# Altium schematic sheet PERIPHERALS.SchDoc
size A4; SheetNumber: 7; SheetTotal: 9
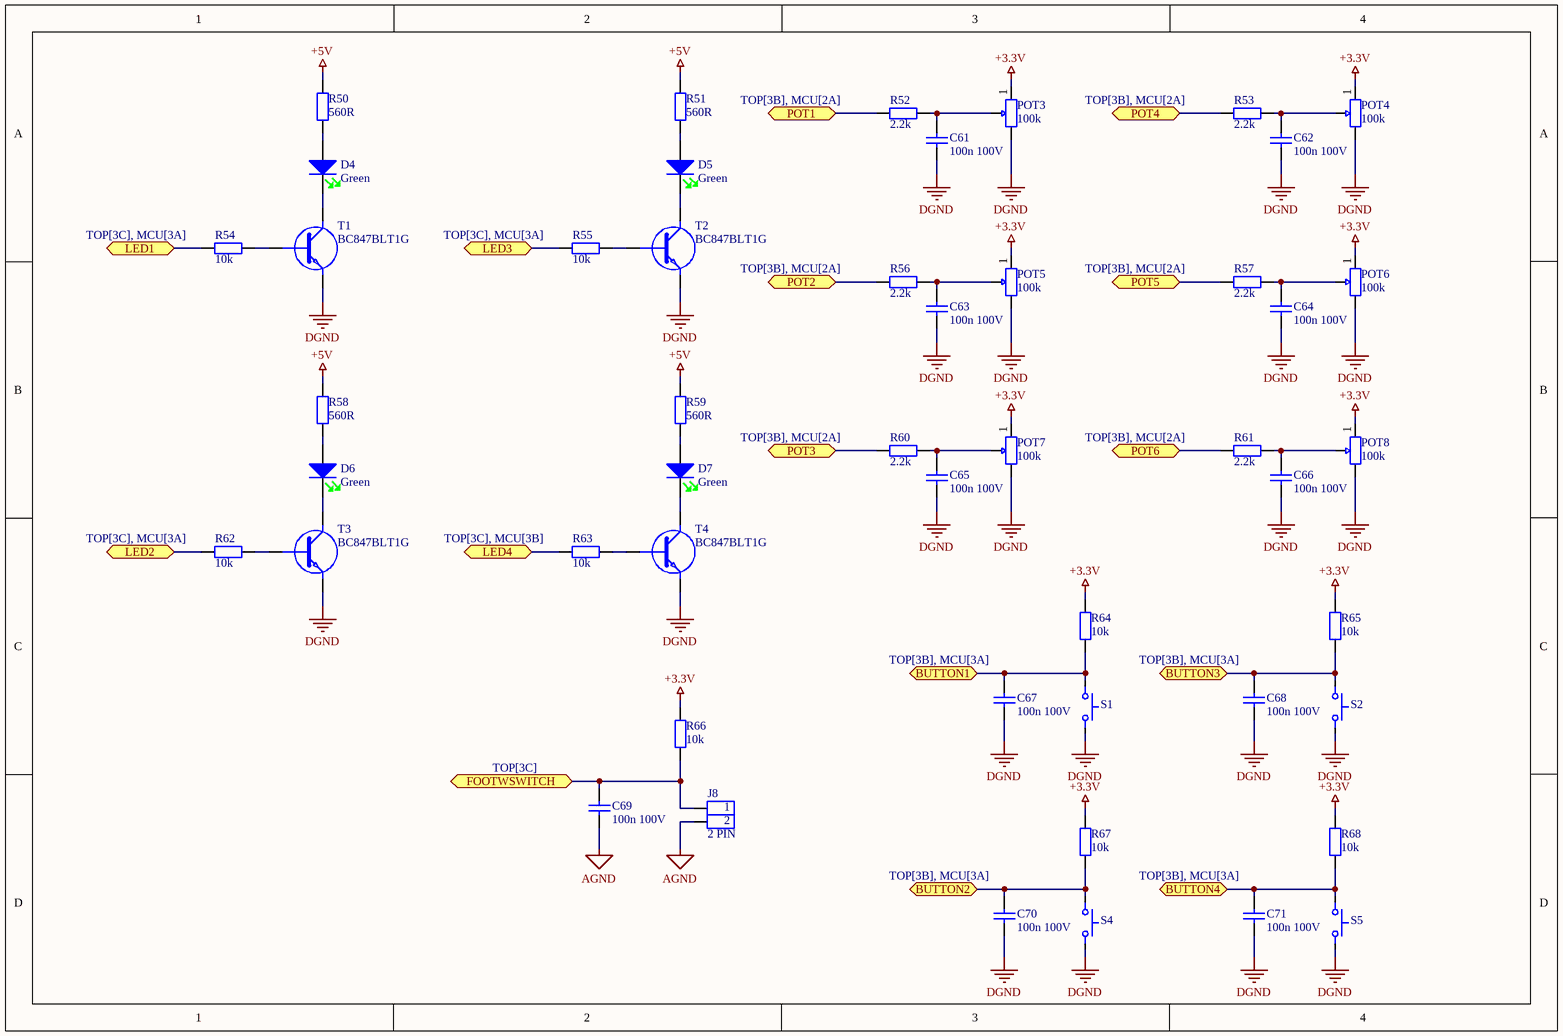
[diagram p0: PERIPHERALS.SchDoc]

## Parts
C61  100n 100V  [CAPACITOR 0805]
C62  100n 100V  [CAPACITOR 0805]
C63  100n 100V  [CAPACITOR 0805]
C64  100n 100V  [CAPACITOR 0805]
C65  100n 100V  [CAPACITOR 0805]
C66  100n 100V  [CAPACITOR 0805]
C67  100n 100V  [CAPACITOR 0805]
C68  100n 100V  [CAPACITOR 0805]
C69  100n 100V  [CAPACITOR 0805]
C70  100n 100V  [CAPACITOR 0805]
C71  100n 100V  [CAPACITOR 0805]
D4  Green  [LED 3MM GREEN]
D5  Green  [LED 3MM GREEN]
D6  Green  [LED 3MM GREEN]
D7  Green  [LED 3MM GREEN]
J8  2 PIN  [MECHANICAL PINHEADER 2P 2.54MM MALE]
POT3  100k  [POTENTIOMETER PTV09A W\H]
POT4  100k  [POTENTIOMETER PTV09A W\H]
POT5  100k  [POTENTIOMETER PTV09A W\H]
POT6  100k  [POTENTIOMETER PTV09A W\H]
POT7  100k  [POTENTIOMETER PTV09A W\H]
POT8  100k  [POTENTIOMETER PTV09A W\H]
R50  560R  [RESISTOR 0805]
R51  560R  [RESISTOR 0805]
R52  2.2k  [RESISTOR 0805]
R53  2.2k  [RESISTOR 0805]
R54  10k  [RESISTOR 0805]
R55  10k  [RESISTOR 0805]
R56  2.2k  [RESISTOR 0805]
R57  2.2k  [RESISTOR 0805]
R58  560R  [RESISTOR 0805]
R59  560R  [RESISTOR 0805]
R60  2.2k  [RESISTOR 0805]
R61  2.2k  [RESISTOR 0805]
R62  10k  [RESISTOR 0805]
R63  10k  [RESISTOR 0805]
R64  10k  [RESISTOR 0805]
R65  10k  [RESISTOR 0805]
R66  10k  [RESISTOR 0805]
R67  10k  [RESISTOR 0805]
R68  10k  [RESISTOR 0805]
S1  6x6mm  [MECHANICAL TACTSWITCH SMD 6x6]  (value not drawn)
S2  6x6mm  [MECHANICAL TACTSWITCH SMD 6x6]  (value not drawn)
S4  6x6mm  [MECHANICAL TACTSWITCH SMD 6x6]  (value not drawn)
S5  6x6mm  [MECHANICAL TACTSWITCH SMD 6x6]  (value not drawn)
T1  BC847BLT1G  [SOT23-3]
T2  BC847BLT1G  [SOT23-3]
T3  BC847BLT1G  [SOT23-3]
T4  BC847BLT1G  [SOT23-3]

## Ports
BUTTON1 (bidir, see TOP[3B], MCU[3A]), BUTTON2 (bidir, see TOP[3B], MCU[3A]), BUTTON3 (bidir, see TOP[3B], MCU[3A]), BUTTON4 (bidir, see TOP[3B], MCU[3A]), FOOTWSWITCH (bidir, see TOP[3C]), LED1 (bidir, see TOP[3C], MCU[3A]), LED2 (bidir, see TOP[3C], MCU[3A]), LED3 (bidir, see TOP[3C], MCU[3A]), LED4 (bidir, see TOP[3C], MCU[3B]), POT1 (bidir, see TOP[3B], MCU[2A]), POT2 (bidir, see TOP[3B], MCU[2A]), POT3 (bidir, see TOP[3B], MCU[2A]), POT4 (bidir, see TOP[3B], MCU[2A]), POT5 (bidir, see TOP[3B], MCU[2A]), POT6 (bidir, see TOP[3B], MCU[2A])

## Nets
+3.3V: POT3.1 POT4.1 POT5.1 POT6.1 POT7.1 POT8.1 R64.2 R65.2 R66.2 R67.2 R68.2
+5V: R50.2 R51.2 R58.2 R59.2
AGND: C69.1 J8.2
DGND: C61.1 C62.1 C63.1 C64.1 C65.1 C66.1 C67.1 C68.1 C70.1 C71.1 POT3.3 POT4.3 POT5.3 POT6.3 POT7.3 POT8.3 S1.2 S2.2 S4.2 S5.2 T1.2(E) T2.2(E) T3.2(E) T4.2(E)
BUTTON1: C67.2 R64.1 S1.1 ; port BUTTON1
BUTTON2: C70.2 R67.1 S4.1 ; port BUTTON2
BUTTON3: C68.2 R65.1 S2.1 ; port BUTTON3
BUTTON4: C71.2 R68.1 S5.1 ; port BUTTON4
FOOTWSWITCH: C69.2 J8.1 R66.1 ; port FOOTWSWITCH
LED1: R54.1 ; port LED1
LED2: R62.1 ; port LED2
LED3: R55.1 ; port LED3
LED4: R63.1 ; port LED4
POT1: R52.1 ; port POT1
POT2: R56.1 ; port POT2
POT3: R60.1 ; port POT3
POT4: R53.1 ; port POT4
POT5: R57.1 ; port POT5
POT6: R61.1 ; port POT6
NetC61_2: C61.2 POT3.2 R52.2
NetC62_2: C62.2 POT4.2 R53.2
NetC63_2: C63.2 POT5.2 R56.2
NetC64_2: C64.2 POT6.2 R57.2
NetC65_2: C65.2 POT7.2 R60.2
NetC66_2: C66.2 POT8.2 R61.2
NetD4_1: D4.1 R50.1
NetD4_2: D4.2 T1.3(C)
NetD5_1: D5.1 R51.1
NetD5_2: D5.2 T2.3(C)
NetD6_1: D6.1 R58.1
NetD6_2: D6.2 T3.3(C)
NetD7_1: D7.1 R59.1
NetD7_2: D7.2 T4.3(C)
NetR54_2: R54.2 T1.1(B)
NetR55_2: R55.2 T2.1(B)
NetR62_2: R62.2 T3.1(B)
NetR63_2: R63.2 T4.1(B)

## Library data of the parts
C61-C71 = Capacitor 100n 100V 10% X7R 0805: Capacitor: ceramic; MLCC; 100nF; 100V; X7R; ±10%; SMD; 0805; Manufacturer: YAGEO; Manufacturer Part Number: CC0805KKX7R0BB104; ComponentLink1Description: Datasheet; ComponentLink1URL: https://www.tme.eu/Document/fbb9415081fcefba62c0f8bbf5b21210/UPY-GPHC_X7R_6.3V-to-50V_20.pdf; Footprint: Capacitor 0805; Price 10pcs [$]: 0.0770; Supplier: TME
D4-D7 = Diode LED Green 3mm THT SMD 20mA: Manufacturer: -; Manufacturer Part Number: -; Footprint: -; Price 10pcs [$]: -; Supplier: -; ComponentLink1Description: Datasheet; ComponentLink1URL: -
J8 = Mechanical Pinheader Male 2pin P=2.54mm THT: Headers & Wire Housings 2.54MM CGRIDIII HDR 2P VERT SR SEL AU; Manufacturer: Molex; Manufacturer Part Number: 90120-0762; ComponentLink1Description: Datasheet; ComponentLink1URL: https://www.mouser.pl/datasheet/2/276/3/0901200765_PCB_HEADERS-2849265.pdf; Price 10pcs [$]: 0.593; Supplier: Mouser
POT3-POT8 = Potentiometer PCB 100k THT Linear PTV09A: Potentiometers 100K 20% 9MM CARBON POT; Manufacturer: Bourns; Manufacturer Part Number: PTV09A-4020U-B104; ComponentLink1Description: Datasheet; ComponentLink1URL: https://www.mouser.pl/datasheet/2/54/ptv09-777818.pdf; Footprint: Potentiometer PTV09A; Price 10pcs [$]: 0.749; Supplier: Mouser
R50 R51 R58 R59 = Resistor 560R 1% 1/8W 0805: Resistor: thick film; SMD; 0805; 560Ω; 0.125W; ±1%; -55÷155°C; Manufacturer: Yageo; Manufacturer Part Number: RC0805FR-07560R; ComponentLink1Description: Datasheet; ComponentLink1URL: https://www.tme.eu/Document/7b8fed8c112f8a94930279c22c957f7f/rc0805yageo.pdf; Footprint: Resistor 0805; Price 10pcs [$]: 0.023; Supplier: TME
R52 R53 R56 R57 R60 R61 = Resistor 2.2k 1% 1/8W 0805: Resistor: thick film; SMD; 0805; 2.2kΩ; 0.125W; ±1%; -55÷155°C; Manufacturer: Yageo; Manufacturer Part Number: RC0805FR-072K2; ComponentLink1Description: Datasheet; ComponentLink1URL: https://www.tme.eu/Document/7b8fed8c112f8a94930279c22c957f7f/rc0805yageo.pdf; Price 10pcs [$]: 0.02250; Supplier: TME
R54 R55 R62-R68 = Resistor 10k 1% 1/8W 0805: Resistor: thick film; SMD; 0805; 10kΩ; 0.125W; ±1%; -55÷155°C; Manufacturer: Yageo; Manufacturer Part Number: RC0805FR-0710K; ComponentLink1Description: Datasheet; ComponentLink1URL: https://www.tme.eu/Document/7b8fed8c112f8a94930279c22c957f7f/rc0805yageo.pdf; Price 10pcs [$]: 0.016; Supplier: TME
S1 S2 S4 S5 = Mechanical Tact Switch 6x6mm THT: Tactile Switches 6 x 6 mm, 5 mm Act Height, 260 gf, Black, Short Crimped, Through Hole, SPST; Manufacturer: CUI Devices; Manufacturer Part Number: TS02-66-50-BK-260-SCR-D; ComponentLink1Description: Datasheet; ComponentLink1URL: https://www.mouser.pl/datasheet/2/670/ts02-2586188.pdf; Price 10pcs [$]: 0.097; Supplier: Mouser
T1-T4 = Transistor NPN 100mA 50V BC847BLT1G: Bipolar Transistors - BJT 100mA 50V NPN; Manufacturer: onsemi; Manufacturer Part Number: BC847BLT1G; Supplier: Mouser; Price 10pcs [$]: 0.094; ComponentLink1Description: Datasheet; ComponentLink1URL: https://www.mouser.pl/datasheet/2/308/BC846ALT1_D-1387679.pdf